# EAGLE design 8ch (EAGLE 8.4.2)
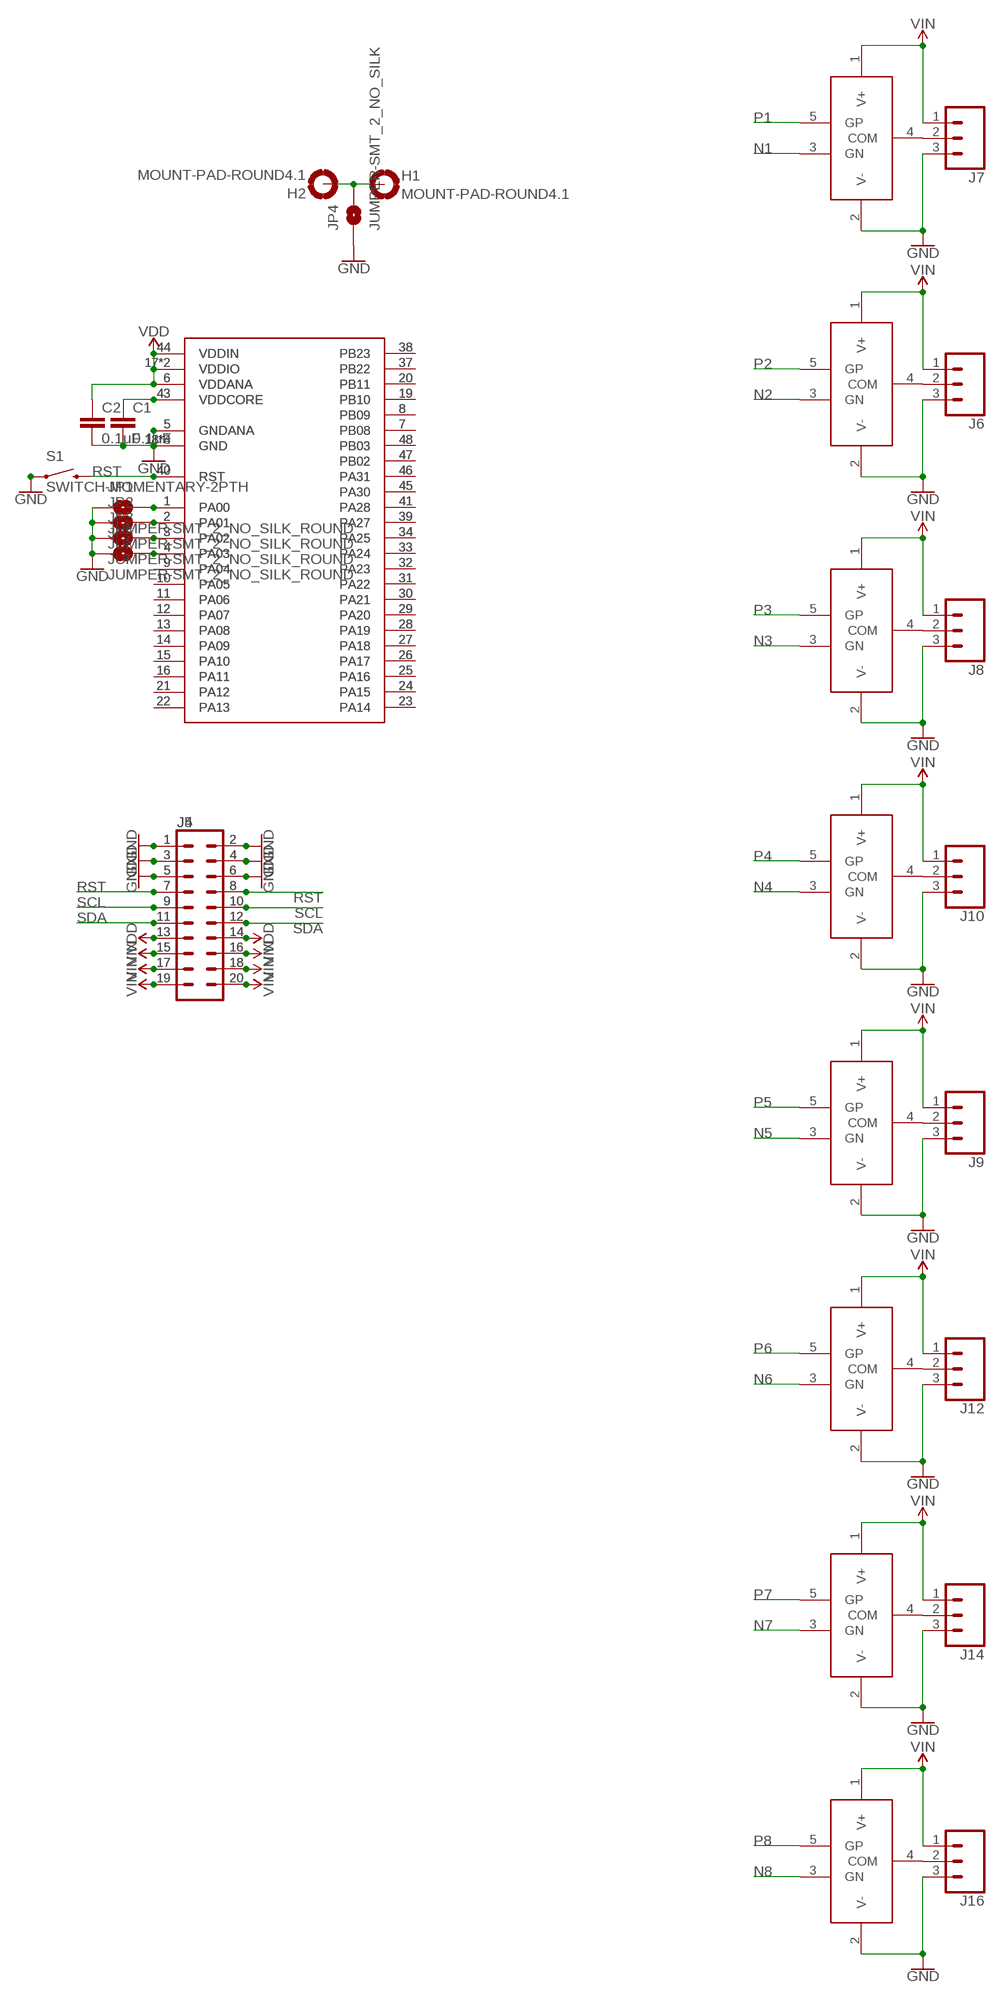
[diagram p0: schematic, sheet 1]

## Parts
C1  0.1uF  0.1UF-0603-100V-10%  [0603]
C2  0.1uF  0.1UF-0603-100V-10%  [0603]
H1  MOUNT-PAD-ROUND4.1  [4,1-PAD]
H2  MOUNT-PAD-ROUND4.1  [4,1-PAD]
J4  CONN_10X2  [2X10]
J5  CONN_10X2  [2X10]
J6  CONN_03-SCREW-5MM  [SCREWTERMINAL-5MM-3]
J7  CONN_03-SCREW-5MM  [SCREWTERMINAL-5MM-3]
J8  CONN_03-SCREW-5MM  [SCREWTERMINAL-5MM-3]
J9  CONN_03-SCREW-5MM  [SCREWTERMINAL-5MM-3]
J10  CONN_03-SCREW-5MM  [SCREWTERMINAL-5MM-3]
J12  CONN_03-SCREW-5MM  [SCREWTERMINAL-5MM-3]
J14  CONN_03-SCREW-5MM  [SCREWTERMINAL-5MM-3]
J16  CONN_03-SCREW-5MM  [SCREWTERMINAL-5MM-3]
JP1  JUMPER-SMT_2_NO_SILK_ROUND  [SMT-JUMPER_2_NO_SILK_ROUND]
JP2  JUMPER-SMT_2_NO_SILK_ROUND  [SMT-JUMPER_2_NO_SILK_ROUND]
JP3  JUMPER-SMT_2_NO_SILK_ROUND  [SMT-JUMPER_2_NO_SILK_ROUND]
JP4  JUMPER-SMT_2_NO_SILK  [SMT-JUMPER_2_NO_SILK]
JP5  JUMPER-SMT_2_NO_SILK_ROUND  [SMT-JUMPER_2_NO_SILK_ROUND]
S1  SWITCH-MOMENTARY-2PTH  [TACTILE-PTH]
U$1  ATSAMD2G1A-M  [QFN48_7X7]
U$2  COMPBJT  [SOT23-5]
U$3  COMPBJT  [SOT23-5]
U$4  COMPBJT  [SOT23-5]
U$5  COMPBJT  [SOT23-5]
U$6  COMPBJT  [SOT23-5]
U$7  ATSAMD2G1A-A  [TQFP48_7X7]
U$8  COMPBJT  [SOT23-5]
U$10  COMPBJT  [SOT23-5]
U$12  COMPBJT  [SOT23-5]

## Nets
GND: C1.2 C2.2 J4.1 J4.2 J4.3 J4.4 J4.5 J4.6 J5.1 J5.2 J5.3 J5.4 J5.5 J5.6 J6.3 J7.3 J8.3 J9.3 J10.3 J12.3 J14.3 J16.3 JP1.1 JP2.1 JP3.1 JP4.1 JP5.1 S1.1 S1.2 U$1.5(GNDANA) U$1.18(GND) U$1.35(GND) U$1.42(GND) U$1.EXP(GND) U$2.2(V-) U$3.2(V-) U$4.2(V-) U$5.2(V-) U$6.2(V-) U$7.5(GNDANA) U$7.18(GND) U$7.35(GND) U$7.42(GND) U$8.2(V-) U$10.2(V-) U$12.2(V-)
N1: U$3.3(GN)
N2: U$2.3(GN)
N3: U$4.3(GN)
N4: U$6.3(GN)
N5: U$5.3(GN)
N6: U$8.3(GN)
N7: U$10.3(GN)
N8: U$12.3(GN)
N$1: H1.B4,1(MOUNT) H2.B4,1(MOUNT) JP4.2
N$2: J6.2 U$2.4(COM)
N$6: J7.2 U$3.4(COM)
N$7: J8.2 U$4.4(COM)
N$8: J9.2 U$5.4(COM)
N$9: J10.2 U$6.4(COM)
N$10: C1.1 U$1.43(VDDCORE) U$7.43(VDDCORE)
N$11: J12.2 U$8.4(COM)
N$13: J14.2 U$10.4(COM)
N$15: J16.2 U$12.4(COM)
N$17: JP1.2 U$1.1(PA00) U$7.1(PA00)
N$18: JP2.2 U$1.2(PA01) U$7.2(PA01)
N$19: JP3.2 U$1.3(PA02) U$7.3(PA02)
N$20: JP5.2 U$1.4(PA03) U$7.4(PA03)
N$21: U$1.9(PA04) U$7.9(PA04)
N$22: U$1.10(PA05) U$7.10(PA05)
N$23: U$1.11(PA06) U$7.11(PA06)
N$24: U$1.12(PA07) U$7.12(PA07)
N$25: U$1.13(PA08) U$7.13(PA08)
N$26: U$1.14(PA09) U$7.14(PA09)
N$27: U$1.15(PA10) U$7.15(PA10)
N$28: U$1.16(PA11) U$7.16(PA11)
N$29: U$1.21(PA12) U$7.21(PA12)
N$30: U$1.22(PA13) U$7.22(PA13)
N$31: U$1.23(PA14) U$7.23(PA14)
N$32: U$1.24(PA15) U$7.24(PA15)
N$33: U$1.25(PA16) U$7.25(PA16)
N$34: U$1.26(PA17) U$7.26(PA17)
N$35: U$1.27(PA18) U$7.27(PA18)
N$36: U$1.28(PA19) U$7.28(PA19)
N$37: U$1.29(PA20) U$7.29(PA20)
N$38: U$1.30(PA21) U$7.30(PA21)
N$39: U$1.31(PA22) U$7.31(PA22)
N$40: U$1.32(PA23) U$7.32(PA23)
N$41: U$1.33(PA24) U$7.33(PA24)
N$42: U$1.34(PA25) U$7.34(PA25)
N$43: U$1.41(PA28) U$7.41(PA28)
N$44: U$1.45(PA30) U$7.45(PA30)
N$45: U$1.46(PA31) U$7.46(PA31)
N$46: U$1.47(PB02) U$7.47(PB02)
N$47: U$1.48(PB03) U$7.48(PB03)
N$48: U$1.7(PB08) U$7.7(PB08)
N$49: U$1.8(PB09) U$7.8(PB09)
N$50: U$1.19(PB10) U$7.19(PB10)
N$51: U$1.20(PB11) U$7.20(PB11)
N$52: U$1.37(PB22) U$7.37(PB22)
N$53: U$1.38(PB23) U$7.38(PB23)
N$54: U$1.39(PA27) U$7.39(PA27)
P1: U$3.5(GP)
P2: U$2.5(GP)
P3: U$4.5(GP)
P4: U$6.5(GP)
P5: U$5.5(GP)
P6: U$8.5(GP)
P7: U$10.5(GP)
P8: U$12.5(GP)
RST: J4.7 J4.8 J5.7 J5.8 S1.3 S1.4 U$1.40(RST) U$7.40(RST)
SCL: J4.9 J4.10 J5.9 J5.10
SDA: J4.11 J4.12 J5.11 J5.12
VDD: C2.1 J4.13 J4.14 J5.13 J5.14 U$1.6(VDDANA) U$1.17(VDDIO) U$1.36(VDDIO) U$1.44(VDDIN) U$7.6(VDDANA) U$7.17(VDDIO) U$7.36(VDDIO) U$7.44(VDDIN)
VIN: J4.15 J4.16 J4.17 J4.18 J4.19 J4.20 J5.15 J5.16 J5.17 J5.18 J5.19 J5.20 J6.1 J7.1 J8.1 J9.1 J10.1 J12.1 J14.1 J16.1 U$2.1(V+) U$3.1(V+) U$4.1(V+) U$5.1(V+) U$6.1(V+) U$8.1(V+) U$10.1(V+) U$12.1(V+)

## Library data of the parts
C1 C2 = SparkFun-Capacitors:0.1UF: 0.1µF ceramic capacitors A capacitor is a passive two-terminal electrical component used to store electrical energy temporarily in an electric field.; PROD_ID: CAP-08390
H1 H2 = holes:MOUNT-PAD-ROUND: MOUNTING PAD, round
J4 J5 = SparkFun-Connectors:CONN_10X2: Multi connection point. Often used as Generic Header-pin footprint for 0.1 inch spaced/style header connections On any of the 0.1 inch spaced packages, you can populate with these: Break Away Headers - Straight <https://www.sparkfun.com/products/116> (PRT-00116) Break Away Male Headers - Right Angle <https://www.sparkfun.com/products/553> (PRT-00553) Female Headers <https://www.sparkfun.com/products/115> (PRT-00115) Break Away Headers - Machine Pin <https://www.sparkfun.com/products/117> (PRT-00117) Break Away Female Headers - Swiss Machine Pin <https://www.sparkfun.com/products/743> (PRT-00743) Special note about the "SPECIAL" package: This was SPECIALLY designed to be used with our Graphic LCD Backpack. Be sure you want to use this! It is not only staggered on each line of header holes, but IT IS ALSO offset of the center point of the top and bottom lines by 5 mil. This causes the headers to lock into place on the "standard" footprint on the LCD screen. The extra squares on the tdocu layer are there simply to reference other pins (if you were to actually populate a longer header than ten long - this is what we do with the backpacks).
J6-J10 J12 J14 J16 = SparkFun-Connectors:CONN_03: Multi connection point. Often used as Generic Header-pin footprint for 0.1 inch spaced/style header connections On any of the 0.1 inch spaced packages, you can populate with these: Break Away Headers - Straight <https://www.sparkfun.com/products/116> (PRT-00116) Break Away Male Headers - Right Angle <https://www.sparkfun.com/products/553> (PRT-00553) Female Headers <https://www.sparkfun.com/products/115> (PRT-00115) Break Away Headers - Machine Pin <https://www.sparkfun.com/products/117> (PRT-00117) Break Away Female Headers - Swiss Machine Pin <https://www.sparkfun.com/products/743> (PRT-00743) Stackable Header - 3 Pin (Female, 0.1") <https://www.sparkfun.com/products/13875> (PRT-13875) For SCREWTERMINALS and SPRING TERMINALS visit here: Screw Terimnals on SparkFun.com <https://www.sparkfun.com/search/results?term=Screw+Terminals> (5mm/3.5mm/2.54mm spacing) This device is also useful as a general connection point to wire up your design to another part of your project. Our various solder wires solder well into these plated through hole pads. Hook-Up Wire - Assortment (Stranded, 22 AWG) <https://www.sparkfun.com/products/11375> (PRT-11375) Hook-Up Wire - Assortment (Solid Core, 22 AWG) <https://www.sparkfun.com/products/11367> (PRT-11367) View the entire wire category on our website here <https://www.sparkfun.com/categories/141> Special notes: Molex polarized connector foot print use with SKU : PRT-08232 with associated crimp pins and housings.; PROD_ID: CONN-10134; SF_SKU: PRT-08433
JP1-JP5 = SparkFun-Jumpers:JUMPER-SMT_2_NO: Normally open jumper This jumper has two pads in close proximity to each other. Apply solder to close the connection. Round pads are easier to solder for beginners, but are a lot larger. SparkFun Product that uses the round pads: SparkFun EL Sequencer <https://www.sparkfun.com/products/12781>
S1 = maxorig:SWITCH-MOMENTARY-2: Various NO switches- pushbuttons, reed, etc; PROD_ID: SWCH-08441
U$1 U$7 = maxorig:ATSAMD2*G1*
U$2-U$6 U$8 U$10 U$12 = maxorig:COMPBJT

## Board
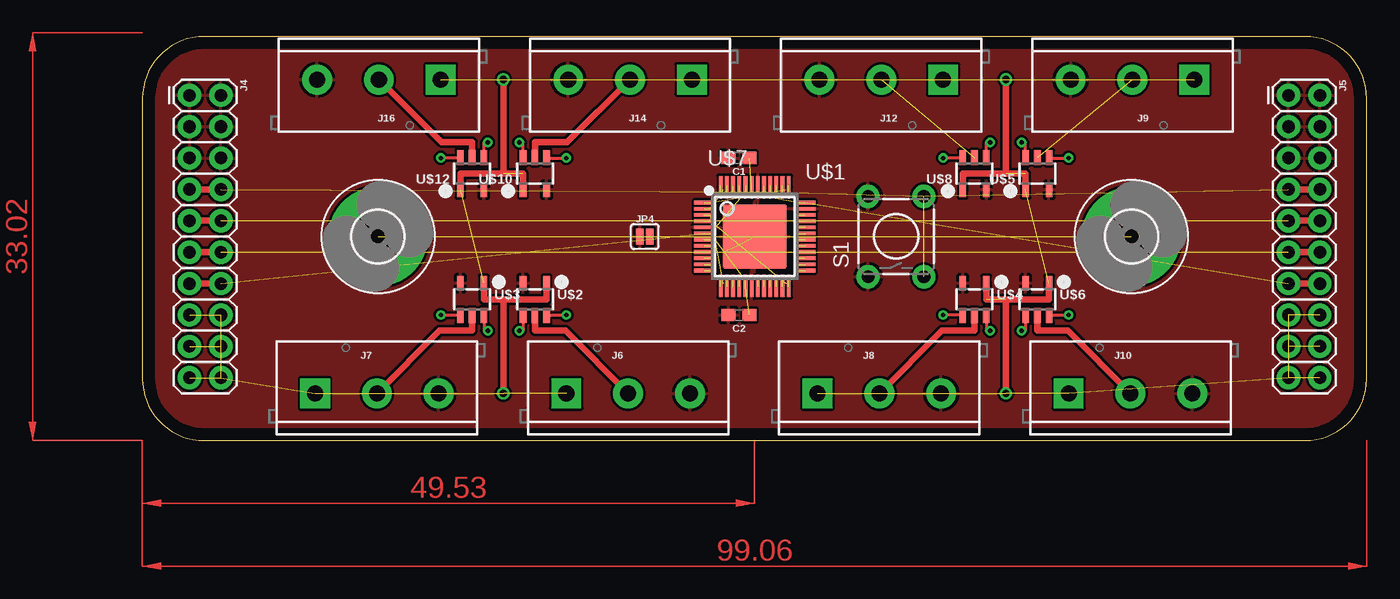
[diagram p1: board, top side]
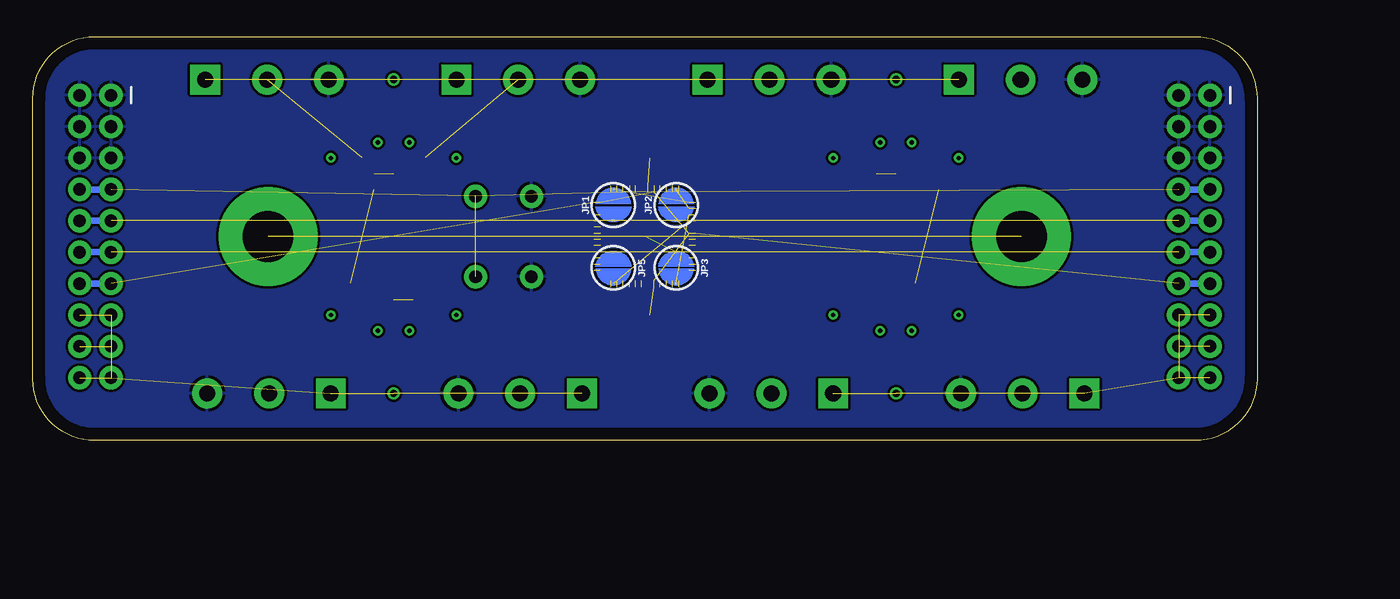
[diagram p2: board, bottom side, seen from below]

Size 99.04 x 32.69 mm. Coordinates in mm from the lower left corner, seen from the top.
Outline: 0,27.69 0,5 arc90 5,0 94.04,0 arc90 99.04,5 99.04,27.69 arc90 94.04,32.69 5,32.69 arc90 0,27.69
Copper layers (1*16): Top 0.035mm / dielectric 1.5mm / Bottom 0.035mm
Design rules "default": minimum track width 10mil, minimum drill 24mil, track to track 8mil, track to pad 8mil, pad to pad 8mil, via to via 8mil, smd to smd 8mil, copper to edge 40mil, drill to drill 8mil, minimum pad ring 10mil, minimum via ring 8mil, stop-mask expansion 4mil, vias tented up to drill 0mil, thermal gap 10mil

### Footprints (pad centres in the part's own frame; a part is rotated, then mirrored left to right if it is on the bottom)
0603 = smd 1.1 x 1: 1 -0.85,0; 2 0.85,0
4,1-PAD = drill 4.1 pad 8: B4,1 0,0
2X10 = drill 1.016 pad 1.88: 1 0,0; 2 0,2.54; 3 2.54,0; 4 2.54,2.54; 5 5.08,0; 6 5.08,2.54; 7 7.62,0; 8 7.62,2.54; 9 10.16,0; 10 10.16,2.54; 11 12.7,0; 12 12.7,2.54; 13 15.24,0; 14 15.24,2.54; 15 17.78,0; 16 17.78,2.54; 17 20.32,0; 18 20.32,2.54; 19 22.86,0; 20 22.86,2.54
SCREWTERMINAL-5MM-3 = drill 1.3 pad 2.413 square: 1 0,0 | drill 1.3 pad 2.413: 2 5,0; 3 10,0
SMT-JUMPER_2_NO_SILK_ROUND = smd 0.152 x 0.305: 1 -1.27,0; 2 1.27,0
SMT-JUMPER_2_NO_SILK = smd 0.635 x 1.27: 1 -0.406,0; 2 0.406,0
TACTILE-PTH = drill 1.016 pad 1.88: 1 -3.251,2.261; 2 3.251,2.261; 3 -3.251,-2.261; 4 3.251,-2.261
QFN48_7X7 = smd 1 x 0.3: 1 -3.575,2.75; 2 -3.575,2.25; 3 -3.575,1.75; 4 -3.575,1.25; 5 -3.575,0.75; 6 -3.575,0.25; 7 -3.575,-0.25; 8 -3.575,-0.75; 9 -3.575,-1.25; 10 -3.575,-1.75; 11 -3.575,-2.25; 12 -3.575,-2.75; 25 3.575,-2.75; 26 3.575,-2.25; 27 3.575,-1.75; 28 3.575,-1.25; 29 3.575,-0.75; 30 3.575,-0.25; 31 3.575,0.25; 32 3.575,0.75; 33 3.575,1.25; 34 3.575,1.75; 35 3.575,2.25; 36 3.575,2.75 | smd 0.3 x 1: 13 -2.75,-3.575; 14 -2.25,-3.575; 15 -1.75,-3.575; 16 -1.25,-3.575; 17 -0.75,-3.575; 18 -0.25,-3.575; 19 0.25,-3.575; 20 0.75,-3.575; 21 1.25,-3.575; 22 1.75,-3.575; 23 2.25,-3.575; 24 2.75,-3.575; 37 2.75,3.575; 38 2.25,3.575; 39 1.75,3.575; 40 1.25,3.575; 41 0.75,3.575; 42 0.25,3.575; 43 -0.25,3.575; 44 -0.75,3.575; 45 -1.25,3.575; 46 -1.75,3.575; 47 -2.25,3.575; 48 -2.75,3.575 | smd 5.2 x 5.2: EXP 0,0
SOT23-5 = smd 0.55 x 1.2: 1 0.95,1.3; 2 -0.95,1.3; 3 -0.95,-1.3; 4 0,-1.3; 5 0.95,-1.3
TQFP48_7X7 = smd 0.3 x 1.6: 1 -2.75,-4.1; 2 -2.25,-4.1; 3 -1.75,-4.1; 4 -1.25,-4.1; 5 -0.75,-4.1; 6 -0.25,-4.1; 7 0.25,-4.1; 8 0.75,-4.1; 9 1.25,-4.1; 10 1.75,-4.1; 11 2.25,-4.1; 12 2.75,-4.1; 25 2.75,4.1; 26 2.25,4.1; 27 1.75,4.1; 28 1.25,4.1; 29 0.75,4.1; 30 0.25,4.1; 31 -0.25,4.1; 32 -0.75,4.1; 33 -1.25,4.1; 34 -1.75,4.1; 35 -2.25,4.1; 36 -2.75,4.1 | smd 1.6 x 0.3: 13 4.1,-2.75; 14 4.1,-2.25; 15 4.1,-1.75; 16 4.1,-1.25; 17 4.1,-0.75; 18 4.1,-0.25; 19 4.1,0.25; 20 4.1,0.75; 21 4.1,1.25; 22 4.1,1.75; 23 4.1,2.25; 24 4.1,2.75; 37 -4.1,2.75; 38 -4.1,2.25; 39 -4.1,1.75; 40 -4.1,1.25; 41 -4.1,0.75; 42 -4.1,0.25; 43 -4.1,-0.25; 44 -4.1,-0.75; 45 -4.1,-1.25; 46 -4.1,-1.75; 47 -4.1,-2.25; 48 -4.1,-2.75

### Placement (x,y rotation side)
C1  48.26,22.86 180 top
C2  48.26,10.16 180 top
H1  19.05,16.51 0 top
H2  80.01,16.51 0 top
J4  3.81,27.94 270 top
J5  92.71,27.94 270 top
J6  34.29,3.81 0 top
J7  13.97,3.81 0 top
J8  54.61,3.81 0 top
J9  85.09,29.21 180 top
J10  74.93,3.81 0 top
J12  64.77,29.21 180 top
J14  44.45,29.21 180 top
J16  24.13,29.21 180 top
JP1  52.07,19.05 90 bottom
JP2  46.99,19.05 90 bottom
JP3  46.99,13.97 270 bottom
JP4  40.64,16.51 0 top
JP5  52.07,13.97 270 bottom
S1  60.96,16.51 90 top
U$1  ATSAMD2G1*A-M  [QFN48_7X7]  49.53,16.51 0 top
U$2  31.75,11.43 0 top
U$3  26.67,11.43 0 top
U$4  67.31,11.43 0 top
U$5  72.39,21.59 180 top
U$6  72.39,11.43 0 top
U$7  ATSAMD2G1*A-A  [TQFP48_7X7]  49.53,16.51 270 top
U$8  67.31,21.59 180 top
U$10  31.75,21.59 180 top
U$12  26.67,21.59 180 top

### Tracks (layer width: path | path; a pad name or v marks a point on that pad's centre or on a via)
GND  (1 unrouted)
  pour Bottom: 0,27.94 arc-90 5.08,33.02 93.98,33.02 arc-90 99.06,27.94 99.06,5.08 arc-90 93.98,0 5.08,0 arc-90 0,5.08
  pour Top: 0,27.94 arc-90 5.08,33.02 93.98,33.02 arc-90 99.06,27.94 99.06,5.08 arc-90 93.98,0 5.08,0 arc-90 0,5.08
N1  (via drill 0.35)
  Top 0.254: U$3.3 24.13,10.13 v24.13,10.16
N2  (via drill 0.35)
  Top 0.254: U$2.3 30.8,8.89 v30.48,8.89
N3  (via drill 0.35)
  Top 0.254: U$4.3 66.36,10.16 v64.77,10.16
N4  (via drill 0.35)
  Top 0.254: U$6.3 71.44,8.89 v71.12,8.89
N5  (via drill 0.35)
  Top 0.254: U$5.3 73.34,22.86 v74.93,22.86
N6  (via drill 0.35)
  Top 0.254: U$8.3 68.26,24.13 v68.58,24.13
N7  (via drill 0.35)
  Top 0.254: U$10.3 32.7,22.86 v34.29,22.86
N8  (via drill 0.35)
  Top 0.254: U$12.3 27.62,24.13 v27.94,24.13
N$1  (2 unrouted)
N$2
  Top 0.508: U$2.4 31.75,8.89 34.21,8.89 J6.2
N$6
  Top 0.508: U$3.4 26.67,8.89 24.05,8.89 J7.2
N$7
  Top 0.508: U$4.4 67.31,8.89 64.69,8.89 J8.2
N$8  (1 unrouted)
N$9
  Top 0.508: U$6.4 72.39,8.89 74.85,8.89 J10.2
N$10  (2 unrouted)
N$11  (1 unrouted)
N$13
  Top 0.508: U$10.4 31.75,24.13 34.37,24.13 J14.2
N$15
  Top 0.508: U$12.4 26.67,24.13 24.21,24.13 J16.2
N$17  (2 unrouted)
N$18  (2 unrouted)
N$19  (2 unrouted)
N$20  (2 unrouted)
N$21  (1 unrouted)
N$22  (1 unrouted)
N$23  (1 unrouted)
N$24  (1 unrouted)
N$25  (1 unrouted)
N$26  (1 unrouted)
N$27  (1 unrouted)
N$28  (1 unrouted)
N$29  (1 unrouted)
N$30  (1 unrouted)
N$31  (1 unrouted)
N$32  (1 unrouted)
N$33  (1 unrouted)
N$34  (1 unrouted)
N$35  (1 unrouted)
N$36  (1 unrouted)
N$37  (1 unrouted)
N$38  (1 unrouted)
N$39  (1 unrouted)
N$40  (1 unrouted)
N$41  (1 unrouted)
N$42  (1 unrouted)
N$43  (1 unrouted)
N$44  (1 unrouted)
N$45  (1 unrouted)
N$46  (1 unrouted)
N$47  (1 unrouted)
N$48  (1 unrouted)
N$49  (1 unrouted)
N$50  (1 unrouted)
N$51  (1 unrouted)
N$52  (1 unrouted)
N$53  (1 unrouted)
N$54  (1 unrouted)
P1  (via drill 0.35)
  Top 0.254: U$3.5 27.62,8.89 v27.94,8.89
P2  (via drill 0.35)
  Top 0.254: U$2.5 32.7,10.16 v34.29,10.16
P3  (via drill 0.35)
  Top 0.254: U$4.5 68.26,8.89 v68.58,8.89
P4  (via drill 0.35)
  Top 0.254: U$6.5 73.34,10.16 v74.93,10.16
P5  (via drill 0.35)
  Top 0.254: U$5.5 71.44,24.13 v71.12,24.13
P6  (via drill 0.35)
  Top 0.254: U$8.5 66.36,22.86 v64.77,22.86
P7  (via drill 0.35)
  Top 0.254: U$10.5 30.8,24.13 v30.48,24.13
P8  (via drill 0.35)
  Top 0.254: U$12.5 25.72,22.86 v24.13,22.86
RST  (5 unrouted)
  Top 0.508: J5.8 J5.7 | J4.7 J4.8
  Bottom 0.508: J5.8 J5.7 | J4.7 J4.8
SCL  (1 unrouted)
  Top 0.508: J4.9 J4.10 | J5.10 J5.9
  Bottom 0.508: J4.9 J4.10 | J5.10 J5.9
SDA  (1 unrouted)
  Top 0.508: J4.11 J4.12 | J5.12 J5.11
  Bottom 0.508: J4.11 J4.12 | J5.12 J5.11
VDD  (10 unrouted)
  Top 0.508: J4.13 J4.14 | J5.14 J5.13
  Bottom 0.508: J4.13 J4.14 | J5.14 J5.13
VIN  (via drill 0.6)  (26 unrouted)
  Top 0.508: U$3.1 27.62,11.43 29.21,11.43 | 29.21,11.43 v29.21,3.81 | 29.21,11.43 32.7,11.43 U$2.1 | U$4.1 68.26,11.43 73.34,11.43 U$6.1 | 69.85,11.43 v69.85,3.81 | U$12.1 25.72,21.59 30.8,21.59 U$10.1 | 29.21,21.59 v29.21,29.21 | U$8.1 66.36,21.59 71.44,21.59 U$5.1 | 69.85,21.59 v69.85,29.21
(copper drawn outside any net)
  shapes: Top area x3